# EAGLE design sop2dip (EAGLE 5.07)
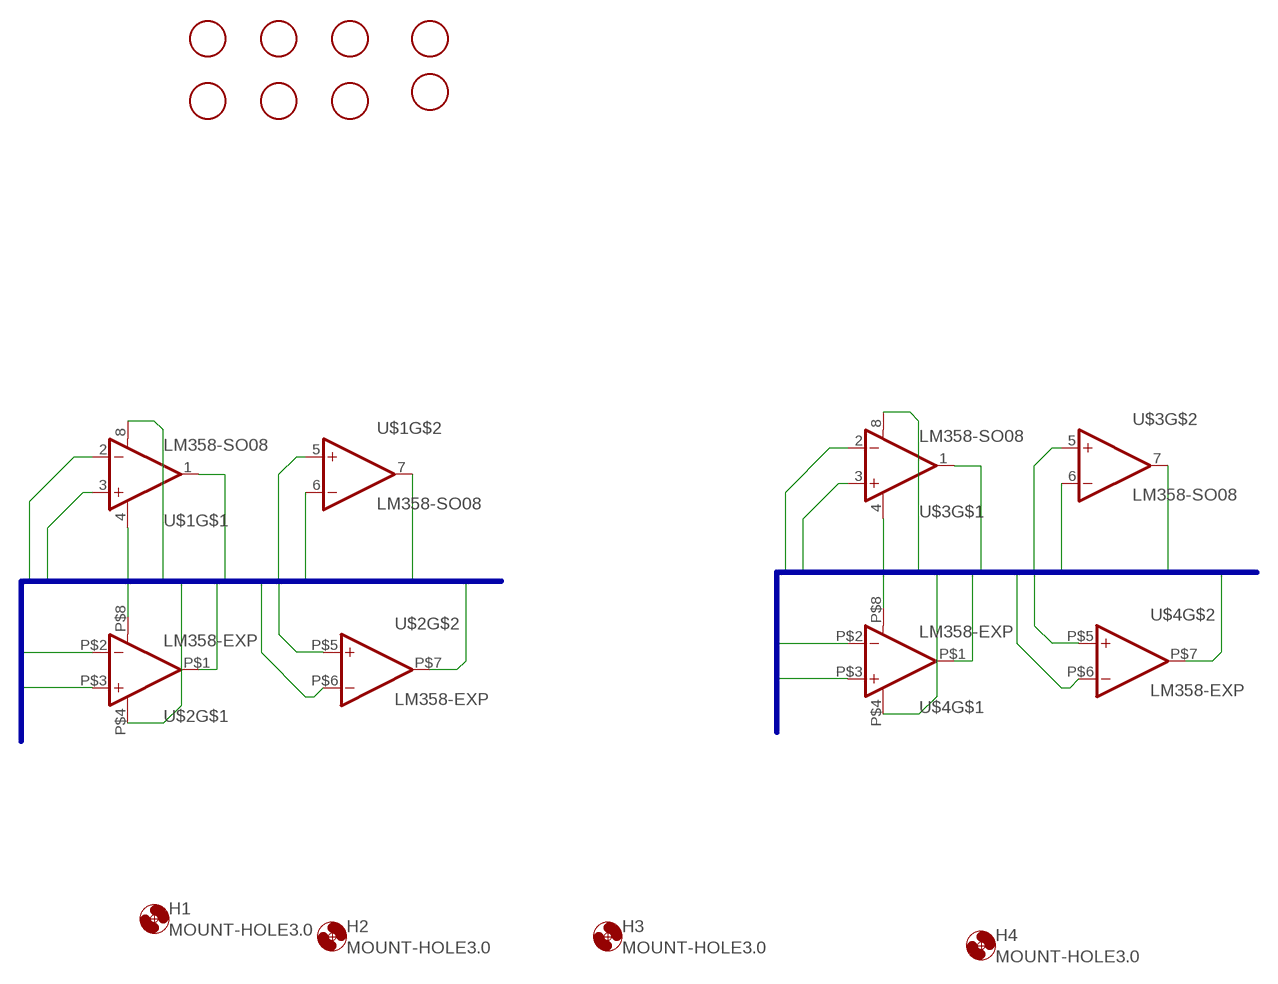
[diagram p0: schematic, sheet 1]

## Parts
H1  MOUNT-HOLE3.0  [3,0]
H2  MOUNT-HOLE3.0  [3,0]
H3  MOUNT-HOLE3.0  [3,0]
H4  MOUNT-HOLE3.0  [3,0]
U$1  LM358-SO08  [SO08]
U$2  LM358-EXP  [DIP8-EXP]
U$3  LM358-SO08  [SO08]
U$4  LM358-EXP  [DIP8-EXP]
U$5  PROTO-PADMID  [RF-EXP-PAD-MID]
U$6  PROTO-PADMID  [RF-EXP-PAD-MID]
U$7  PROTO-PADMID  [RF-EXP-PAD-MID]
U$8  PROTO-PADMID  [RF-EXP-PAD-MID]
U$9  PROTO-PADMID  [RF-EXP-PAD-MID]
U$10  PROTO-PADMID  [RF-EXP-PAD-MID]
U$11  PROTO-PADMID  [RF-EXP-PAD-MID]
U$12  PROTO-PADMID  [RF-EXP-PAD-MID]

## Nets
SOP1: U$1.1(OUT) U$2.P$1(OUT)
SOP2: U$1.2(-IN) U$2.P$2(-IN)
SOP3: U$1.3(+IN) U$2.P$3(+IN)
SOP4: U$1.4(V-) U$2.P$4(V-)
SOP5: U$1.5(+IN) U$2.P$5(+IN)
SOP6: U$1.6(-IN) U$2.P$6(-IN)
SOP7: U$1.7(OUT) U$2.P$7(OUT)
SOP8: U$1.8(V+) U$2.P$8(V+)
SOP9: U$3.6(-IN) U$4.P$6(-IN)
SOP10: U$3.7(OUT) U$4.P$7(OUT)
SOP11: U$3.4(V-) U$4.P$4(V-)
SOP12: U$3.3(+IN) U$4.P$3(+IN)
SOP13: U$3.2(-IN) U$4.P$2(-IN)
SOP14: U$3.8(V+) U$4.P$8(V+)
SOP15: U$3.1(OUT) U$4.P$1(OUT)
SOP16: U$3.5(+IN) U$4.P$5(+IN)
Unconnected: U$5.P$2 U$6.P$2 U$7.P$2 U$8.P$2 U$9.P$2 U$10.P$2 U$11.P$2 U$12.P$2

## Buses
SOP[1..8]

## Library data of the parts
H1-H4 = holes:MOUNT-HOLE: MOUNTING HOLE with drill center marker
U$1-U$4 = digital-toy:LM358
U$5-U$12 = dtoy-RF:PROTO-PAD

## Board
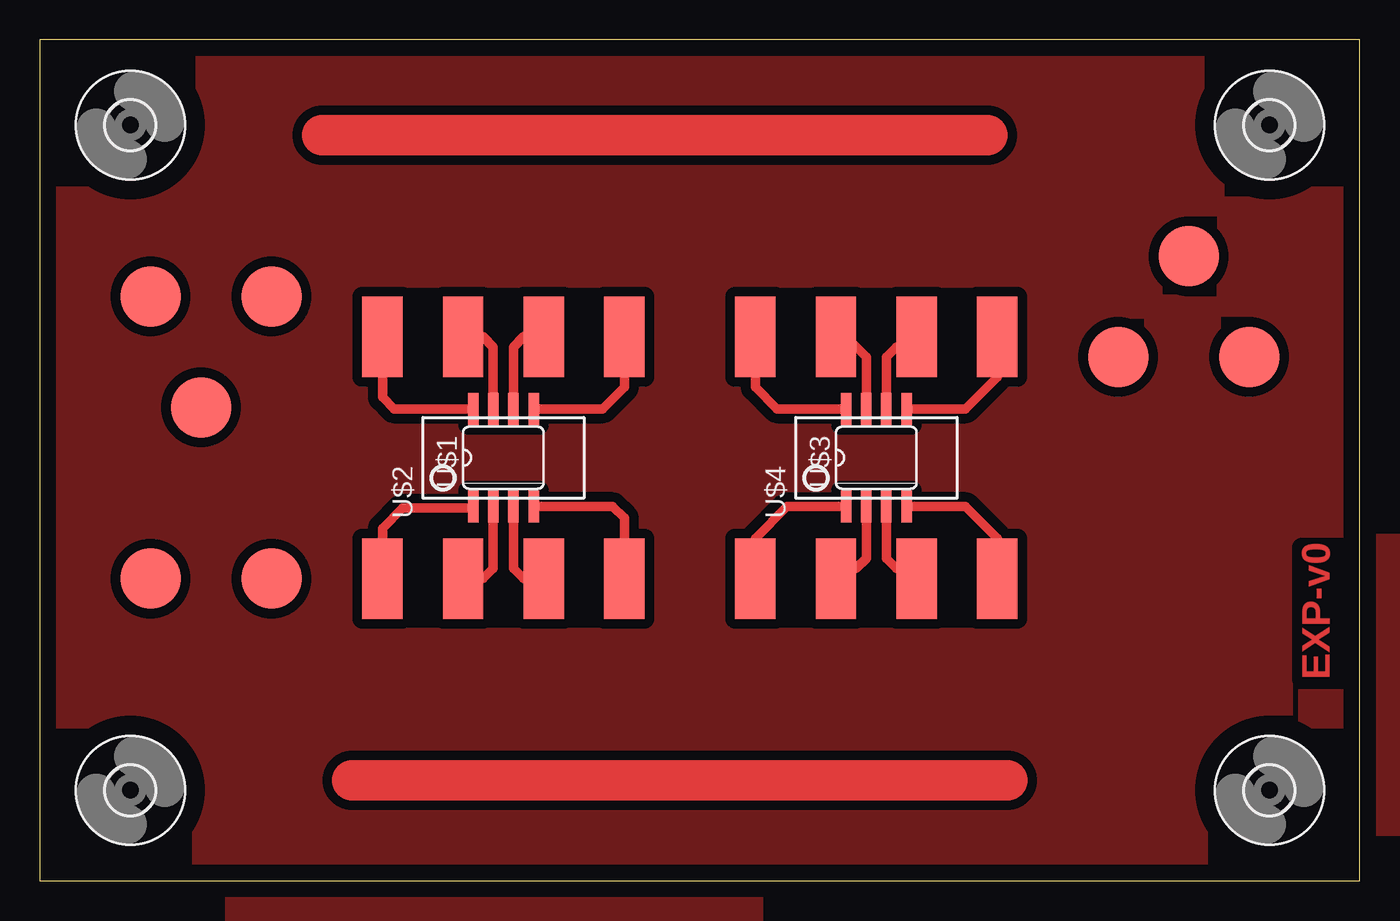
[diagram p1: board, top side]

Size 83.17 x 53.01 mm. Coordinates in mm from the lower left corner, seen from the top.
Outline: 0,0 83.17,0 83.17,53.01 0,53.01 0,0
Copper layers (1*16): Top 0.035mm / dielectric 1.5mm / Bottom 0.035mm
Design rules "default": minimum track width 10mil, minimum drill 24mil, track to track 8mil, track to pad 8mil, pad to pad 8mil, via to via 8mil, smd to smd 8mil, copper to edge 40mil, drill to drill 8mil, minimum pad ring 10mil, minimum via ring 8mil, stop-mask expansion 4mil, vias tented up to drill 0mil, thermal gap 10mil

### Footprints (pad centres in the part's own frame; a part is rotated, then mirrored left to right if it is on the bottom)
3,0 = hole 3: 0,0
SO08 = smd 0.66 x 2.032: 1 -1.905,-3.073; 2 -0.635,-3.073; 3 0.635,-3.073; 4 1.905,-3.073; 5 1.905,3.073; 6 0.635,3.073; 7 -0.635,3.073; 8 -1.905,3.073
DIP8-EXP = smd 2.54 x 5.08: P$1 -7.62,-7.62; P$2 -2.54,-7.62; P$3 2.54,-7.62; P$4 7.62,-7.62; P$5 7.62,7.62; P$6 2.54,7.62; P$7 -2.54,7.62; P$8 -7.62,7.62
RF-EXP-PAD-MID = smd 3.81 x 3.81: P$2 0,0

### Placement (x,y rotation side)
H1  5.71,5.71 0 top
H2  5.71,47.62 0 top
H3  77.47,47.62 0 top
H4  77.47,5.71 0 top
U$1  29.21,26.67 0 top
U$2  29.21,26.67 0 top
U$3  52.7,26.67 0 top
U$4  52.7,26.67 0 top
U$5  6.99,36.83 0 top
U$6  10.16,29.84 0 top
U$7  72.39,39.37 0 top
U$8  14.61,36.83 0 top
U$9  76.2,33.02 0 top
U$10  67.94,33.02 0 top
U$11  6.99,19.05 0 top
U$12  14.61,19.05 0 top

### Tracks (layer width: path | path; a pad name or v marks a point on that pad's centre or on a via)
GND
  pour Top (isolate 0.61): 82.55,52.7 83.19,49.53 85.09,6.35 83.82,0 25.4,-1.91 -0.64,-0.64 0,52.7
N$1
  Top 2.54: 19.68,6.35 60.96,6.35
N$2
  Top 2.54: 17.78,46.99 59.69,46.99
SOP1
  Top 0.61: U$2.P$1 21.59,22.23 22.86,23.5 27.2,23.5 U$1.1
SOP2
  Top 0.61: U$1.2 28.57,19.68 27.94,19.05 U$2.P$2
SOP3
  Top 0.61: U$1.3 29.84,19.68 30.48,19.05 U$2.P$3
SOP4
  Top 0.61: U$1.4 36.09,23.6 36.83,22.86 U$2.P$4
SOP5
  Top 0.61: U$1.5 35.46,29.74 36.83,31.11 U$2.P$5
SOP6
  Top 0.61: U$1.6 29.84,33.66 30.48,34.29 U$2.P$6
SOP7
  Top 0.61: U$1.7 28.57,33.66 27.94,34.29 U$2.P$7
SOP8
  Top 0.61: U$1.8 22.33,29.74 21.59,30.48 U$2.P$8
SOP9
  Top 0.61: U$3.6 53.34,33.02 53.98,33.66 54.61,33.66 U$4.P$6
SOP10
  Top 0.61: U$3.7 52.07,33.02 50.8,34.29 U$4.P$7
SOP11
  Top 0.61: U$3.4 58.32,23.6 60.33,21.59 U$4.P$4
SOP12
  Top 0.61: U$3.3 53.34,20.32 53.98,19.68 54.61,19.68 U$4.P$3
SOP13
  Top 0.61: U$3.2 52.07,20.32 51.44,19.68 50.8,19.68 U$4.P$2
SOP14
  Top 0.61: U$3.8 46.46,29.74 45.09,31.11 U$4.P$8
SOP15
  Top 0.61: U$3.1 47.09,23.6 45.09,21.59 U$4.P$1
SOP16
  Top 0.61: U$3.5 58.32,29.74 60.33,31.75 U$4.P$5

### Text on the board
Top: EXP-v0